# Altium schematic sheet Sheet1.SchDoc
size D; SheetNumber: 1; SheetTotal: 1
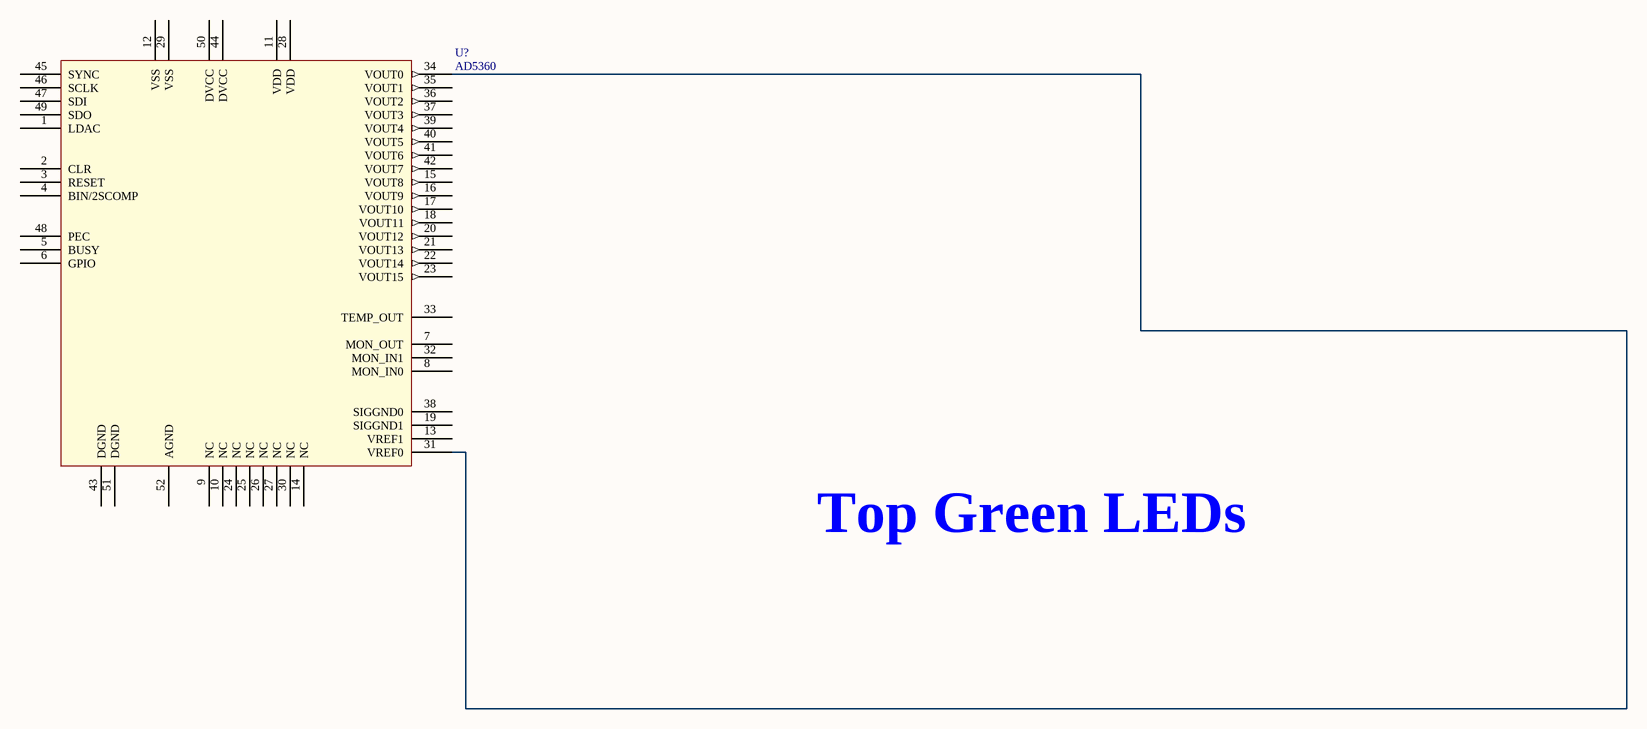
[diagram p0: Sheet1.SchDoc]

## Parts
U?  AD5360  [QFP65P1200X1200-52L]

## Nets
NetU?_31: U?.31(VREF0) U?.34(VOUT0)

Not connected (* = marked no-connect by the designer): U? 1(LDAC) 2(CLR) 3(RESET) 4(BIN/2SCOMP) 5(BUSY) 6(GPIO) 7(MON_OUT) 8(MON_IN0) 9(NC) 10(NC) 11(VDD) 12(VSS) 13(VREF1) 14(NC) 15(VOUT8) 16(VOUT9) 17(VOUT10) 18(VOUT11) 19(SIGGND1) 20(VOUT12) 21(VOUT13) 22(VOUT14) 23(VOUT15) 24(NC) 25(NC) 26(NC) 27(NC) 28(VDD) 29(VSS) 30(NC) 32(MON_IN1) 33(TEMP_OUT) 35(VOUT1) 36(VOUT2) 37(VOUT3) 38(SIGGND0) 39(VOUT4) 40(VOUT5) 41(VOUT6) 42(VOUT7) 43(DGND) 44(DVCC) 45(SYNC) 46(SCLK) 47(SDI) 48(PEC) 49(SDO) 50(DVCC) 51(DGND) 52(AGND)

## Notes on the sheet
- Top Green LEDs

## Library data of the parts
U? = AD5360: DAC 16 Ch